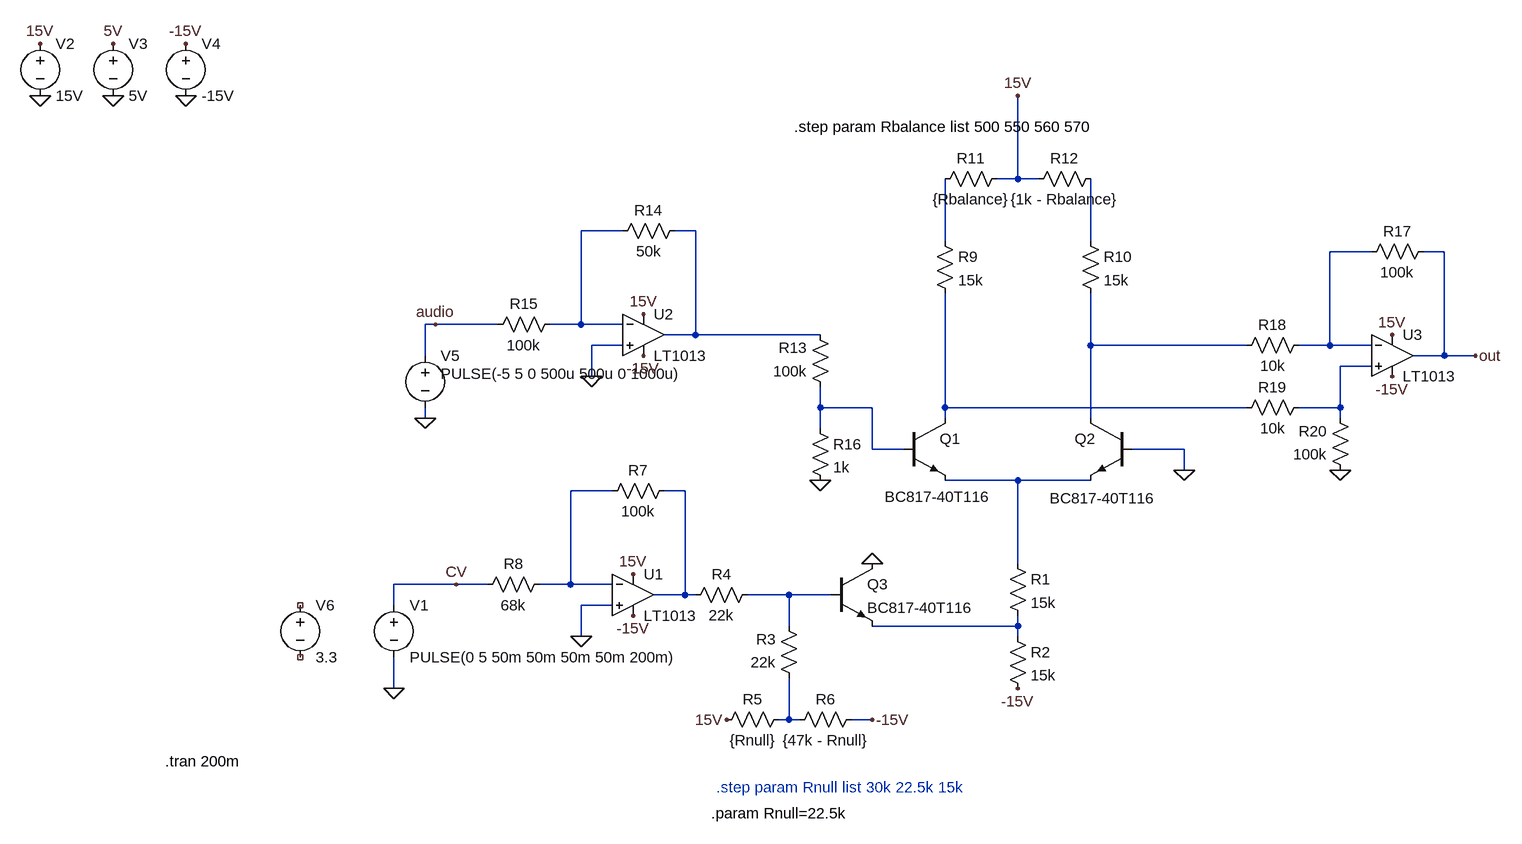
[diagram p0: schematic vca.asc]
vca.asc, the LTspice schematic file:
Version 4
SHEET 1 1112 680
WIRE 352 -368 352 -496
WIRE 352 -368 320 -368
WIRE 384 -368 352 -368
WIRE -256 -288 -320 -288
WIRE -144 -288 -176 -288
WIRE 240 -272 240 -368
WIRE 464 -272 464 -368
WIRE 896 -256 832 -256
WIRE 1008 -256 976 -256
WIRE -544 -144 -560 -144
WIRE -448 -144 -544 -144
WIRE -320 -144 -320 -288
WIRE -320 -144 -368 -144
WIRE -256 -144 -320 -144
WIRE -144 -128 -144 -288
WIRE -144 -128 -192 -128
WIRE 48 -128 -144 -128
WIRE -256 -112 -304 -112
WIRE 464 -112 464 -192
WIRE 704 -112 464 -112
WIRE 832 -112 832 -256
WIRE 832 -112 784 -112
WIRE 896 -112 832 -112
WIRE -560 -96 -560 -144
WIRE 1008 -96 1008 -256
WIRE 1008 -96 960 -96
WIRE 1056 -96 1008 -96
WIRE 896 -80 848 -80
WIRE -304 -64 -304 -112
WIRE 48 -16 48 -48
WIRE 128 -16 48 -16
WIRE 240 -16 240 -192
WIRE 704 -16 240 -16
WIRE 848 -16 848 -80
WIRE 848 -16 784 -16
WIRE -560 0 -560 -16
WIRE 240 0 240 -16
WIRE 464 0 464 -112
WIRE 848 0 848 -16
WIRE 48 16 48 -16
WIRE 128 48 128 -16
WIRE 176 48 128 48
WIRE 608 48 528 48
WIRE 608 80 608 48
WIRE 352 96 240 96
WIRE 464 96 352 96
WIRE -272 112 -336 112
WIRE -160 112 -192 112
WIRE 352 224 352 96
WIRE -512 256 -608 256
WIRE -464 256 -512 256
WIRE -336 256 -336 112
WIRE -336 256 -384 256
WIRE -272 256 -336 256
WIRE -160 272 -160 112
WIRE -160 272 -208 272
WIRE -144 272 -160 272
WIRE 0 272 -64 272
WIRE 64 272 0 272
WIRE -608 288 -608 256
WIRE -272 288 -320 288
WIRE 0 320 0 272
WIRE 352 320 352 304
WIRE 352 320 128 320
WIRE -320 336 -320 288
WIRE 352 336 352 320
WIRE -608 416 -608 368
WIRE 0 464 0 400
WIRE 0 464 -16 464
WIRE 16 464 0 464
WIRE 128 464 96 464
FLAG 352 416 -15V
FLAG 128 224 0
FLAG 128 464 -15V
FLAG -96 464 15V
FLAG -240 240 15V
FLAG -240 304 -15V
FLAG -320 336 0
FLAG -608 416 0
FLAG -512 256 CV
FLAG 608 80 0
FLAG -224 -160 15V
FLAG -224 -96 -15V
FLAG -304 -64 0
FLAG 48 96 0
FLAG -1152 -496 0
FLAG -1040 -496 0
FLAG -928 -496 0
FLAG -1152 -576 15V
FLAG -1040 -576 5V
FLAG -928 -576 -15V
FLAG 352 -496 15V
FLAG 928 -128 15V
FLAG 928 -64 -15V
FLAG 848 80 0
FLAG 1056 -96 out
FLAG -560 0 0
FLAG -544 -144 audio
DATAFLAG 1008 -128 ""
SYMBOL npn 176 0 R0
WINDOW 3 -29 121 Left 2
SYMATTR InstName Q1
SYMATTR Value BC817-40T116
SYMBOL npn 528 0 M0
WINDOW 3 -37 123 Left 2
SYMATTR InstName Q2
SYMATTR Value BC817-40T116
SYMBOL res 336 208 R0
SYMATTR InstName R1
SYMATTR Value 15k
SYMBOL res 336 320 R0
SYMATTR InstName R2
SYMATTR Value 15k
SYMBOL npn 64 224 R0
SYMATTR InstName Q3
SYMATTR Value BC817-40T116
SYMBOL res 16 416 R180
WINDOW 0 36 76 Left 2
WINDOW 3 36 40 Left 2
SYMATTR InstName R3
SYMATTR Value 22k
SYMBOL res -48 256 R90
WINDOW 0 0 56 VBottom 2
WINDOW 3 32 56 VTop 2
SYMATTR InstName R4
SYMATTR Value 22k
SYMBOL res 0 448 R90
WINDOW 0 0 56 VBottom 2
WINDOW 3 32 56 VTop 2
SYMATTR InstName R5
SYMATTR Value {Rnull}
SYMBOL res 112 448 R90
WINDOW 0 0 56 VBottom 2
WINDOW 3 32 56 VTop 2
SYMATTR InstName R6
SYMATTR Value {47k - Rnull}
SYMBOL OpAmps\\LT1013 -240 208 R0
SYMATTR InstName U1
SYMBOL res -176 96 R90
WINDOW 0 0 56 VBottom 2
WINDOW 3 32 56 VTop 2
SYMATTR InstName R7
SYMATTR Value 100k
SYMBOL res -368 240 R90
WINDOW 0 0 56 VBottom 2
WINDOW 3 32 56 VTop 2
SYMATTR InstName R8
SYMATTR Value 68k
SYMBOL voltage -608 272 R0
WINDOW 123 0 0 Left 0
WINDOW 39 0 0 Left 0
SYMATTR InstName V1
SYMATTR Value PULSE(0 5 50m 50m 50m 50m 200m)
SYMBOL res 224 -288 R0
SYMATTR InstName R9
SYMATTR Value 15k
SYMBOL res 448 -288 R0
SYMATTR InstName R10
SYMATTR Value 15k
SYMBOL res 336 -384 R90
WINDOW 0 0 56 VBottom 2
WINDOW 3 32 56 VTop 2
SYMATTR InstName R11
SYMATTR Value {Rbalance}
SYMBOL res 480 -384 R90
WINDOW 0 0 56 VBottom 2
WINDOW 3 32 56 VTop 2
SYMATTR InstName R12
SYMATTR Value {1k - Rbalance}
SYMBOL res 64 -32 R180
WINDOW 0 36 76 Left 2
WINDOW 3 36 40 Left 2
SYMATTR InstName R13
SYMATTR Value 100k
SYMBOL OpAmps\\LT1013 -224 -192 R0
SYMATTR InstName U2
SYMBOL res -160 -304 R90
WINDOW 0 0 56 VBottom 2
WINDOW 3 32 56 VTop 2
SYMATTR InstName R14
SYMATTR Value 50k
SYMBOL res -352 -160 R90
WINDOW 0 0 56 VBottom 2
WINDOW 3 32 56 VTop 2
SYMATTR InstName R15
SYMATTR Value 100k
SYMBOL res 32 0 R0
SYMATTR InstName R16
SYMATTR Value 1k
SYMBOL voltage -1152 -592 R0
WINDOW 123 0 0 Left 0
WINDOW 39 0 0 Left 0
SYMATTR InstName V2
SYMATTR Value 15V
SYMBOL voltage -1040 -592 R0
WINDOW 123 0 0 Left 0
WINDOW 39 0 0 Left 0
SYMATTR InstName V3
SYMATTR Value 5V
SYMBOL voltage -928 -592 R0
WINDOW 123 0 0 Left 0
WINDOW 39 0 0 Left 0
SYMATTR InstName V4
SYMATTR Value -15V
SYMBOL OpAmps\\LT1013 928 -160 R0
SYMATTR InstName U3
SYMBOL res 992 -272 R90
WINDOW 0 0 56 VBottom 2
WINDOW 3 32 56 VTop 2
SYMATTR InstName R17
SYMATTR Value 100k
SYMBOL res 800 -128 R90
WINDOW 0 0 56 VBottom 2
WINDOW 3 32 56 VTop 2
SYMATTR InstName R18
SYMATTR Value 10k
SYMBOL res 800 -32 R90
WINDOW 0 0 56 VBottom 2
WINDOW 3 32 56 VTop 2
SYMATTR InstName R19
SYMATTR Value 10k
SYMBOL res 864 96 R180
WINDOW 0 36 76 Left 2
WINDOW 3 36 40 Left 2
SYMATTR InstName R20
SYMATTR Value 100k
SYMBOL voltage -560 -112 R0
WINDOW 3 24 44 Left 2
WINDOW 123 0 0 Left 0
WINDOW 39 0 0 Left 0
SYMATTR Value PULSE(-5 5 0 500u 500u 0 1000u)
SYMATTR InstName V5
SYMBOL voltage -752 272 R0
WINDOW 123 0 0 Left 0
WINDOW 39 0 0 Left 0
SYMATTR InstName V6
SYMATTR Value 3.3
TEXT -960 528 Left 2 !.tran 200m
TEXT -112 568 Left 2 ;.step param Rnull list 30k 22.5k 15k
TEXT -120 608 Left 2 !.param Rnull=22.5k
TEXT 8 -448 Left 2 !.step param Rbalance list 500 550 560 570

The netlist it stands for:
* vca.asc
Q1 N009 N008 N010 0 BC817-40T116
Q2 N006 0 N010 0 BC817-40T116
R1 N010 N014 15k
R2 N014 -15V 15k
Q3 0 N013 N014 0 BC817-40T116
R3 N015 N013 22k
R4 N013 N012 22k
R5 N015 15V {Rnull}
R6 -15V N015 {47k - Rnull}
XU1 0 N011 15V -15V N012 LT1013  ; pins In+ In- V+ V- OUT
R7 N012 N011 100k
R8 N011 CV 68k
V1 CV 0 PULSE(0 5 50m 50m 50m 50m 200m)
R9 N003 N009 15k
R10 N004 N006 15k
R11 15V N003 {Rbalance}
R12 N004 15V {1k - Rbalance}
R13 N008 N002 100k
XU2 0 N001 15V -15V N002 LT1013  ; pins In+ In- V+ V- OUT
R14 N002 N001 50k
R15 N001 audio 100k
R16 N008 0 1k
V2 15V 0 15V
V3 5V 0 5V
V4 -15V 0 -15V
XU3 N007 N005 15V -15V out LT1013  ; pins In+ In- V+ V- OUT
R17 out N005 100k
R18 N005 N006 10k
R19 N007 N009 10k
R20 0 N007 100k
V5 audio 0 PULSE(-5 5 0 500u 500u 0 1000u)
V6 NC_01 NC_02 3.3
.model NPN NPN
.model PNP PNP
.lib standard.bjt
.tran 200m
* .step param Rnull list 30k 22.5k 15k
.param Rnull=22.5k
.step param Rbalance list 500 550 560 570
.lib LTC.lib
.backanno
.end